# EAGLE schematic FlexEval (EAGLE 9.6.2)

## Sheet 1 of 5
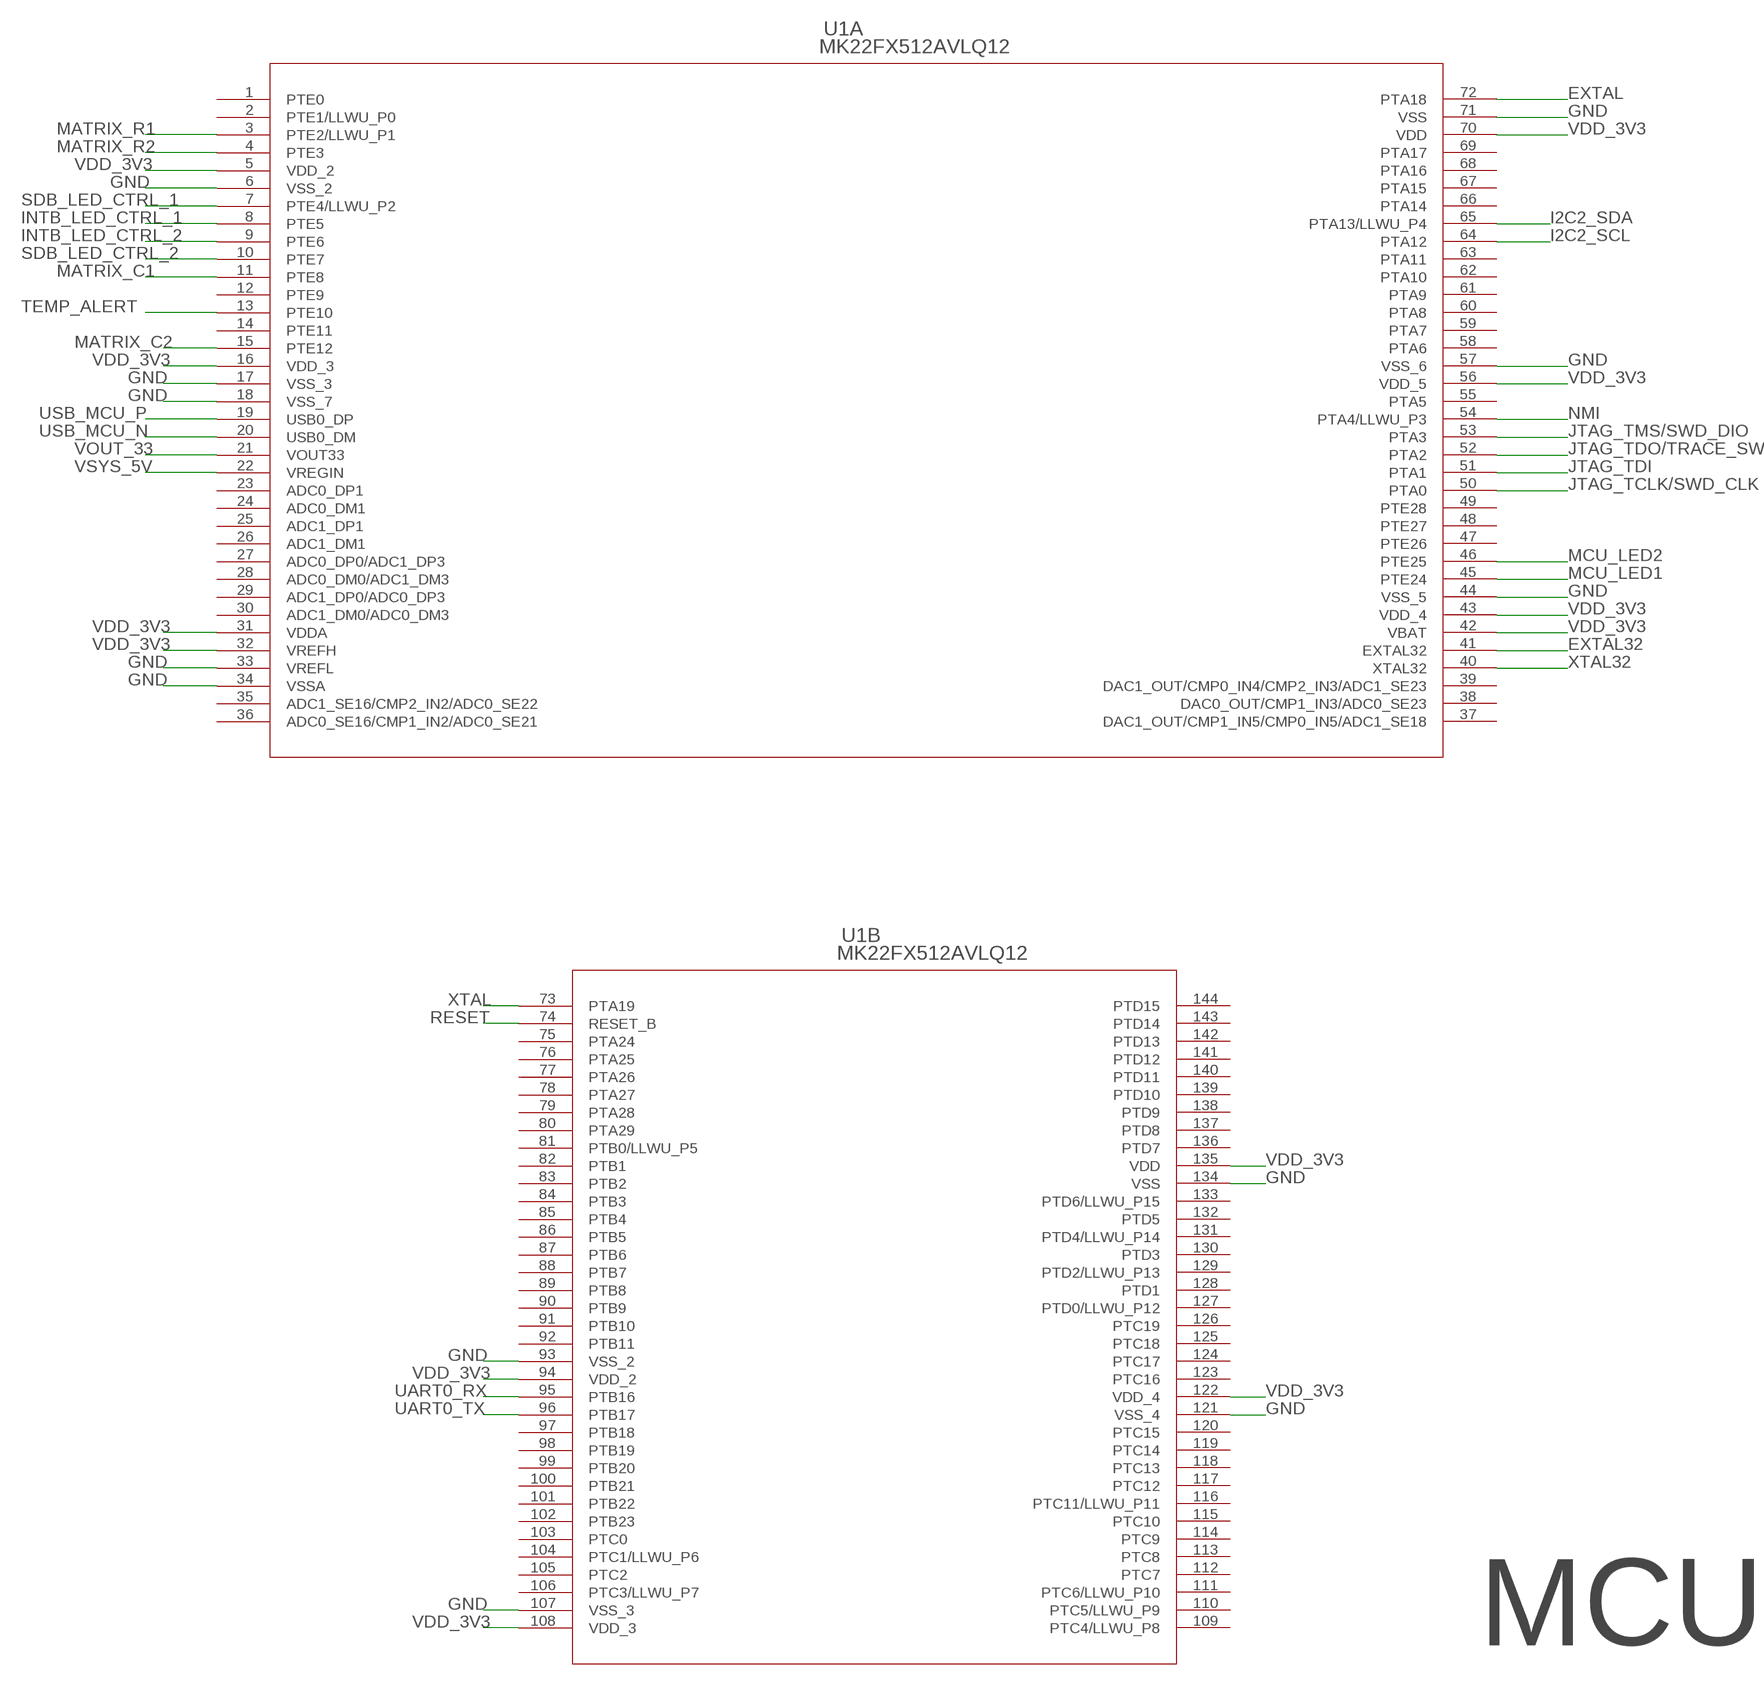
[diagram p0: schematic, sheet 1]

### Parts
U1  MK22FX512AVLQ12  [LQFP-144_20X20X1.6]

### Nets
EXTAL: U1.72(A:PTA18) ; also sheet 2
EXTAL32: U1.41(A:EXTAL32) ; also sheet 2
GND: U1.6(A:VSS_2) U1.17(A:VSS_3) U1.18(A:VSS_7) U1.33(A:VREFL) U1.34(A:VSSA) U1.44(A:VSS_5) U1.57(A:VSS_6) U1.71(A:VSS) U1.93(B:VSS_2) U1.107(B:VSS_3) U1.121(B:VSS_4) U1.134(B:VSS) ; also sheet 2,3,5
I2C2_SCL: U1.64(A:PTA12) ; also sheet 2,3,5
I2C2_SDA: U1.65(A:PTA13/LLWU_P4) ; also sheet 2,3,5
INTB_LED_CTRL_1: U1.8(A:PTE5) ; also sheet 3
INTB_LED_CTRL_2: U1.9(A:PTE6) ; also sheet 3
JTAG_TCLK/SWD_CLK: U1.50(A:PTA0) ; also sheet 2
JTAG_TDI: U1.51(A:PTA1) ; also sheet 2
JTAG_TDO/TRACE_SWO: U1.52(A:PTA2) ; also sheet 2
JTAG_TMS/SWD_DIO: U1.53(A:PTA3) ; also sheet 2
MATRIX_C1: U1.11(A:PTE8) ; also sheet 5
MATRIX_C2: U1.15(A:PTE12) ; also sheet 5
MATRIX_R1: U1.3(A:PTE2/LLWU_P1) ; also sheet 5
MATRIX_R2: U1.4(A:PTE3) ; also sheet 5
MCU_LED1: U1.45(A:PTE24) ; also sheet 2
MCU_LED2: U1.46(A:PTE25) ; also sheet 2
NMI: U1.54(A:PTA4/LLWU_P3) ; also sheet 2
RESET: U1.74(B:RESET_B) ; also sheet 2
SDB_LED_CTRL_1: U1.7(A:PTE4/LLWU_P2) ; also sheet 3
SDB_LED_CTRL_2: U1.10(A:PTE7) ; also sheet 3
TEMP_ALERT: U1.13(A:PTE10) ; also sheet 5
UART0_RX: U1.95(B:PTB16) ; also sheet 2
UART0_TX: U1.96(B:PTB17) ; also sheet 2
USB_MCU_N: U1.20(A:USB0_DM) ; also sheet 2
USB_MCU_P: U1.19(A:USB0_DP) ; also sheet 2
VDD_3V3: U1.5(A:VDD_2) U1.16(A:VDD_3) U1.31(A:VDDA) U1.32(A:VREFH) U1.42(A:VBAT) U1.43(A:VDD_4) U1.56(A:VDD_5) U1.70(A:VDD) U1.94(B:VDD_2) U1.108(B:VDD_3) U1.122(B:VDD_4) U1.135(B:VDD) ; also sheet 2,3,5
VOUT_33: U1.21(A:VOUT33) ; also sheet 2
VSYS_5V: U1.22(A:VREGIN) ; also sheet 2,3
XTAL: U1.73(B:PTA19) ; also sheet 2
XTAL32: U1.40(A:XTAL32) ; also sheet 2
Unconnected: U1.1(A:PTE0) U1.2(A:PTE1/LLWU_P0) U1.12(A:PTE9) U1.14(A:PTE11) U1.23(A:ADC0_DP1) U1.24(A:ADC0_DM1) U1.25(A:ADC1_DP1) U1.26(A:ADC1_DM1) U1.27(A:ADC0_DP0/ADC1_DP3) U1.28(A:ADC0_DM0/ADC1_DM3) U1.29(A:ADC1_DP0/ADC0_DP3) U1.30(A:ADC1_DM0/ADC0_DM3) U1.35(A:ADC1_SE16/CMP2_IN2/ADC0_SE22) U1.36(A:ADC0_SE16/CMP1_IN2/ADC0_SE21) U1.37(A:DAC1_OUT/CMP1_IN5/CMP0_IN5/ADC1_SE18) U1.38(A:DAC0_OUT/CMP1_IN3/ADC0_SE23) U1.39(A:DAC1_OUT/CMP0_IN4/CMP2_IN3/ADC1_SE23) U1.47(A:PTE26) U1.48(A:PTE27) U1.49(A:PTE28) U1.55(A:PTA5) U1.58(A:PTA6) U1.59(A:PTA7) U1.60(A:PTA8) U1.61(A:PTA9) U1.62(A:PTA10) U1.63(A:PTA11) U1.66(A:PTA14) U1.67(A:PTA15) U1.68(A:PTA16) U1.69(A:PTA17) U1.75(B:PTA24) U1.76(B:PTA25) U1.77(B:PTA26) U1.78(B:PTA27) U1.79(B:PTA28) U1.80(B:PTA29) U1.81(B:PTB0/LLWU_P5) U1.82(B:PTB1) U1.83(B:PTB2) U1.84(B:PTB3) U1.85(B:PTB4) U1.86(B:PTB5) U1.87(B:PTB6) U1.88(B:PTB7) U1.89(B:PTB8) U1.90(B:PTB9) U1.91(B:PTB10) U1.92(B:PTB11) U1.97(B:PTB18) U1.98(B:PTB19) U1.99(B:PTB20) U1.100(B:PTB21) U1.101(B:PTB22) U1.102(B:PTB23) U1.103(B:PTC0) U1.104(B:PTC1/LLWU_P6) U1.105(B:PTC2) U1.106(B:PTC3/LLWU_P7) U1.109(B:PTC4/LLWU_P8) U1.110(B:PTC5/LLWU_P9) U1.111(B:PTC6/LLWU_P10) U1.112(B:PTC7) U1.113(B:PTC8) U1.114(B:PTC9) U1.115(B:PTC10) U1.116(B:PTC11/LLWU_P11) U1.117(B:PTC12) U1.118(B:PTC13) U1.119(B:PTC14) U1.120(B:PTC15) U1.123(B:PTC16) U1.124(B:PTC17) U1.125(B:PTC18) U1.126(B:PTC19) U1.127(B:PTD0/LLWU_P12) U1.128(B:PTD1) U1.129(B:PTD2/LLWU_P13) U1.130(B:PTD3) U1.131(B:PTD4/LLWU_P14) U1.132(B:PTD5) U1.133(B:PTD6/LLWU_P15) U1.136(B:PTD7) U1.137(B:PTD8) U1.138(B:PTD9) U1.139(B:PTD10) U1.140(B:PTD11) U1.141(B:PTD12) U1.142(B:PTD13) U1.143(B:PTD14) U1.144(B:PTD15)

### Notes on the sheet
- MCU

## Sheet 2 of 5
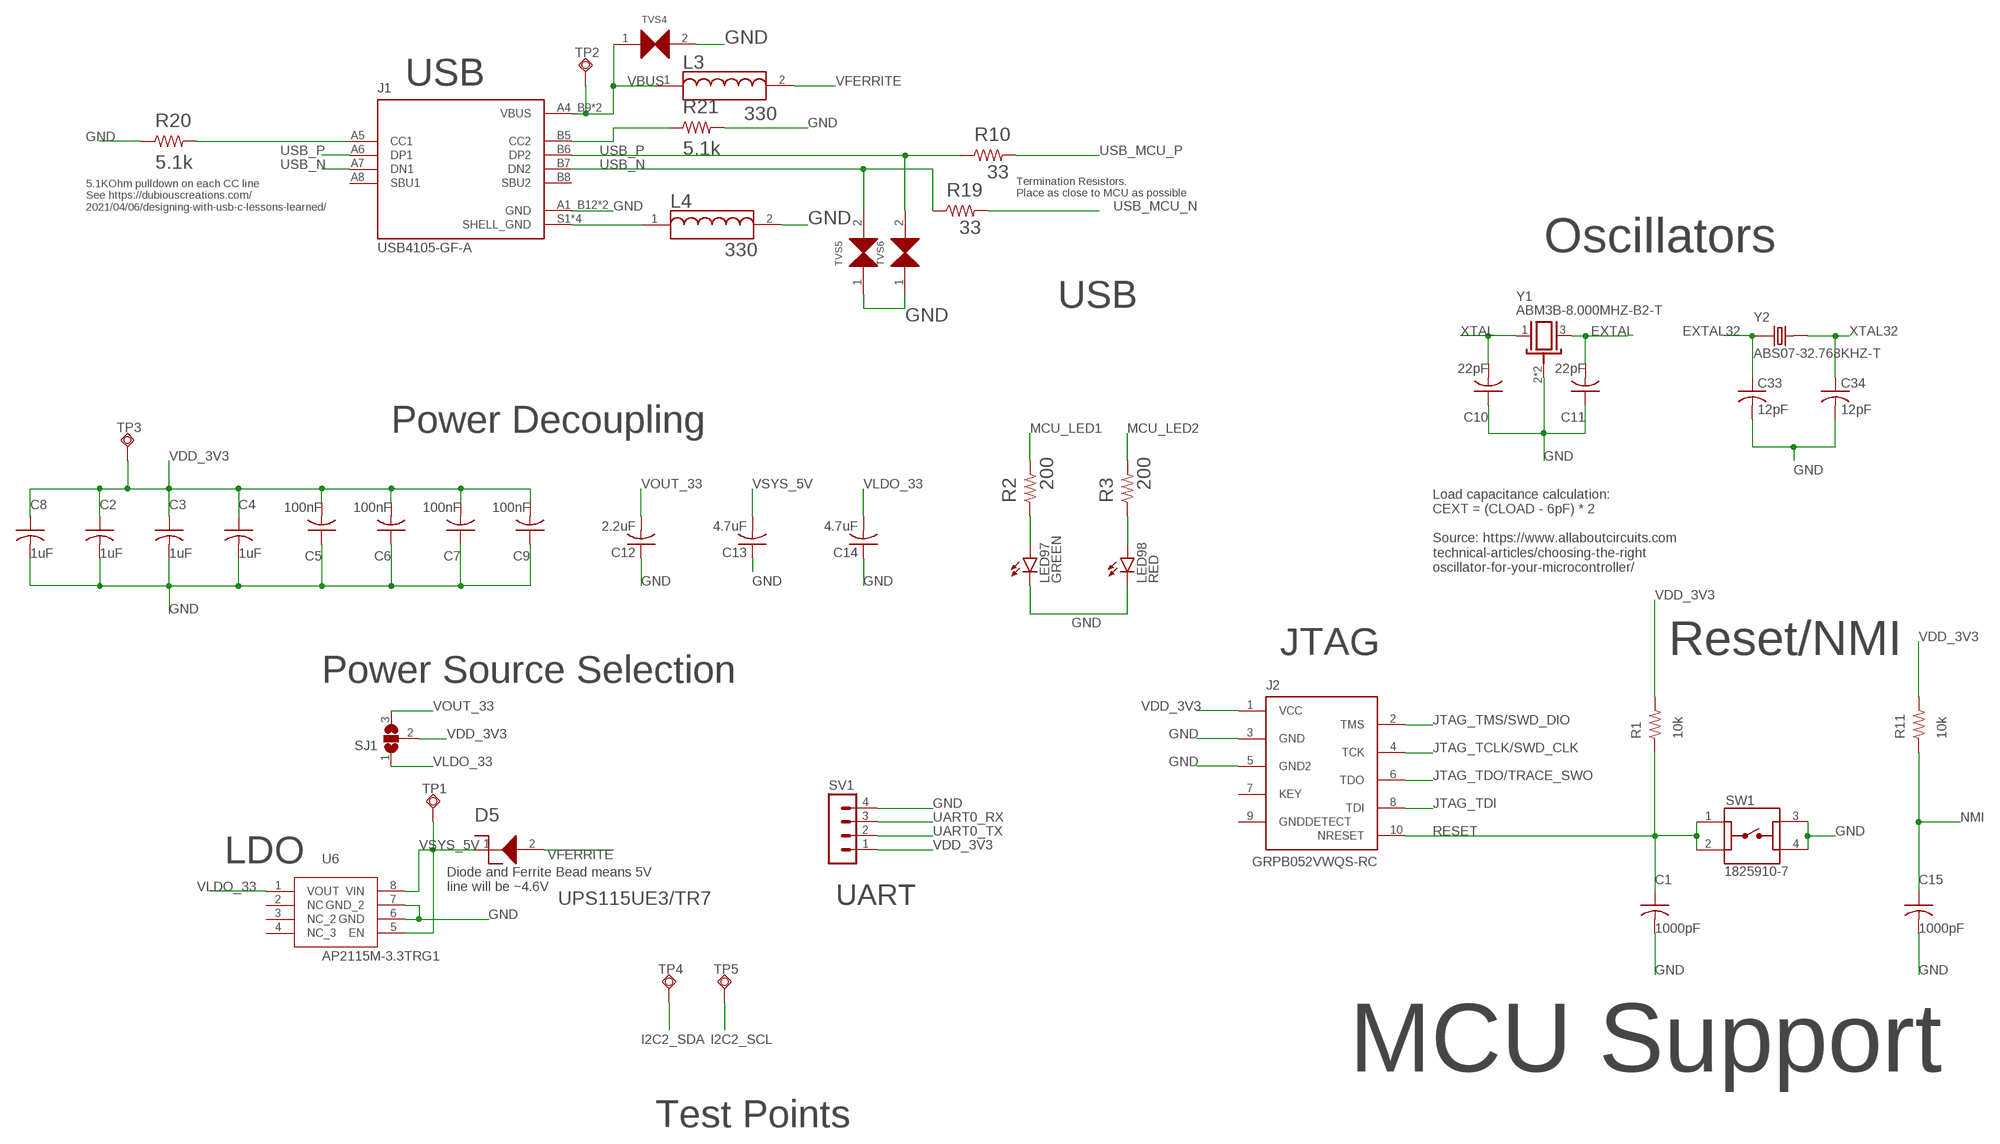
[diagram p1: schematic, sheet 2]

### Parts
C1  1000pF  C-USC1206  [C1206]
C2  1uF  C-USC1206  [C1206]
C3  1uF  C-USC1206  [C1206]
C4  1uF  C-USC1206  [C1206]
C5  100nF  C-USC1206  [C1206]
C6  100nF  C-USC1206  [C1206]
C7  100nF  C-USC1206  [C1206]
C8  1uF  C-USC1206  [C1206]
C9  100nF  C-USC1206  [C1206]
C10  22pF  C-USC1206  [C1206]
C11  22pF  C-USC1206  [C1206]
C12  2.2uF  C-USC0805  [C0805]
C13  4.7uF  C-USC0805  [C0805]
C14  4.7uF  C-USC0805  [C0805]
C15  1000pF  C-USC1206  [C1206]
C33  12pF  C-USC0805  [C0805]
C34  12pF  C-USC0805  [C0805]
D5  UPS115UE3/TR7  [UPS115UE3/TR7]
J1  USB4105-GF-A  [GCT_USB4105-GF-A]
J2  GRPB052VWQS-RC  [DEBUG]
L3  330  782853331SMD  [78285333]
L4  330  782853331SMD  [78285333]
LED97  GREEN  LEDSML1206  [SML1206]
LED98  RED  LEDSML1206  [SML1206]
R1  10k  R-US_R1206  [R1206]
R2  200  R-US_R0805  [R0805]
R3  200  R-US_R0805  [R0805]
R10  33  R-US_R0805  [R0805]
R11  10k  R-US_R1206  [R1206]
R19  33  R-US_R0805  [R0805]
R20  5.1k  R-US_R0805  [R0805]
R21  5.1k  R-US_R0805  [R0805]
SJ1  SJ2W  [SJ_2]
SV1  MA04-1  [MA04-1]
SW1  1825910-7  [SW_1825910-7]
TP1  TPSQTP20R  [TP20R]
TP2  TPSQTP20R  [TP20R]
TP3  TPSQTP20R  [TP20R]
TP4  TPSQTP20R  [TP20R]
TP5  TPSQTP20R  [TP20R]
TVS4  0603ESDA2-TR2  [0603ESDA2-TR2]
TVS5  0603ESDA2-TR2  [0603ESDA2-TR2]
TVS6  0603ESDA2-TR2  [0603ESDA2-TR2]
U6  AP2115M-3.3TRG1  [SOIC127P600X175-8N]
Y1  ABM3B-8.000MHZ-B2-T  [OSC_ABM3B-8.000MHZ-B2-T]
Y2  ABS07-32.768KHZ-T  [XTAL_ABS07-32.768KHZ-T]

### Nets
EXTAL: C11.2 Y1.3 ; also sheet 1
EXTAL32: C33.1 Y2.1 ; also sheet 1
GND: C1.2 C2.2 C3.2 C4.2 C5.1 C6.1 C7.1 C8.2 C9.1 C10.1 C11.1 C12.1 C13.1 C14.1 C15.2 C33.2 C34.2 J1.A1_B12(GND) J1.B1_A12(GND) J2.3(GND) J2.5(GND2) L4.2 LED97.C LED98.C R20.1 R21.2 SV1.4 SW1.3 SW1.4 TVS4.2 TVS5.1 TVS6.1 U6.6(GND) U6.7(GND_2) Y1.2(GND) Y1.4(GND) ; also sheet 1,3,5
I2C2_SCL: TP5.TP ; also sheet 1,3,5
I2C2_SDA: TP4.TP ; also sheet 1,3,5
JTAG_TCLK/SWD_CLK: J2.4(TCK) ; also sheet 1
JTAG_TDI: J2.8(TDI) ; also sheet 1
JTAG_TDO/TRACE_SWO: J2.6(TDO) ; also sheet 1
JTAG_TMS/SWD_DIO: J2.2(TMS) ; also sheet 1
MCU_LED1: R2.2 ; also sheet 1
MCU_LED2: R3.2 ; also sheet 1
N$1: LED97.A R2.1
N$2: LED98.A R3.1
N$12: J1.S1(SHELL_GND) J1.S2(SHELL_GND) J1.S3(SHELL_GND) J1.S4(SHELL_GND) L4.1
N$13: J1.B5(CC2) R21.1
N$14: J1.A5(CC1) R20.2
NMI: C15.1 R11.1 ; also sheet 1
RESET: C1.1 J2.10(NRESET) R1.1 SW1.1 SW1.2 ; also sheet 1
UART0_RX: SV1.3 ; also sheet 1
UART0_TX: SV1.2 ; also sheet 1
USB_MCU_N: R19.2 ; also sheet 1
USB_MCU_P: R10.2 ; also sheet 1
USB_N: J1.A7(DN1) J1.B7(DN2) R19.1 TVS5.2
USB_P: J1.A6(DP1) J1.B6(DP2) R10.1 TVS6.2
VBUS: J1.A4_B9(VBUS) J1.B4_A9(VBUS) L3.1 TP2.TP TVS4.1
VDD_3V3: C2.1 C3.1 C4.1 C5.2 C6.2 C7.2 C8.1 C9.2 J2.1(VCC) R1.2 R11.2 SJ1.2 SV1.1 TP3.TP ; also sheet 1,3,5
VFERRITE: D5.2 L3.2
VLDO_33: C14.2 SJ1.1 U6.1(VOUT)
VOUT_33: C12.2 SJ1.3 ; also sheet 1
VSYS_5V: C13.2 D5.1 TP1.TP U6.5(EN) U6.8(VIN) ; also sheet 1,3
XTAL: C10.2 Y1.1 ; also sheet 1
XTAL32: C34.1 Y2.2 ; also sheet 1
Unconnected: J1.A8(SBU1) J1.B8(SBU2) J2.7(KEY) J2.9(GNDDETECT) U6.2(NC) U6.3(NC_2) U6.4(NC_3)

### Notes on the sheet
- USB
- Termination Resistors.
  Place as close to MCU as possible
- 5.1KOhm pulldown on each CC line
  See https://dubiouscreations.com/
  2021/04/06/designing-with-usb-c-lessons-learned/
- Oscillators
- USB
- Power Decoupling
- Load capacitance calculation:
  CEXT = (CLOAD - 6pF) * 2
  
  Source: https://www.allaboutcircuits.com
  technical-articles/choosing-the-right
  oscillator-for-your-microcontroller/
- JTAG | Reset/NMI
- Power Source Selection
- LDO
- Diode and Ferrite Bead means 5V
  line will be ~4.6V
- UART
- MCU Support
- Test Points

## Sheet 3 of 5
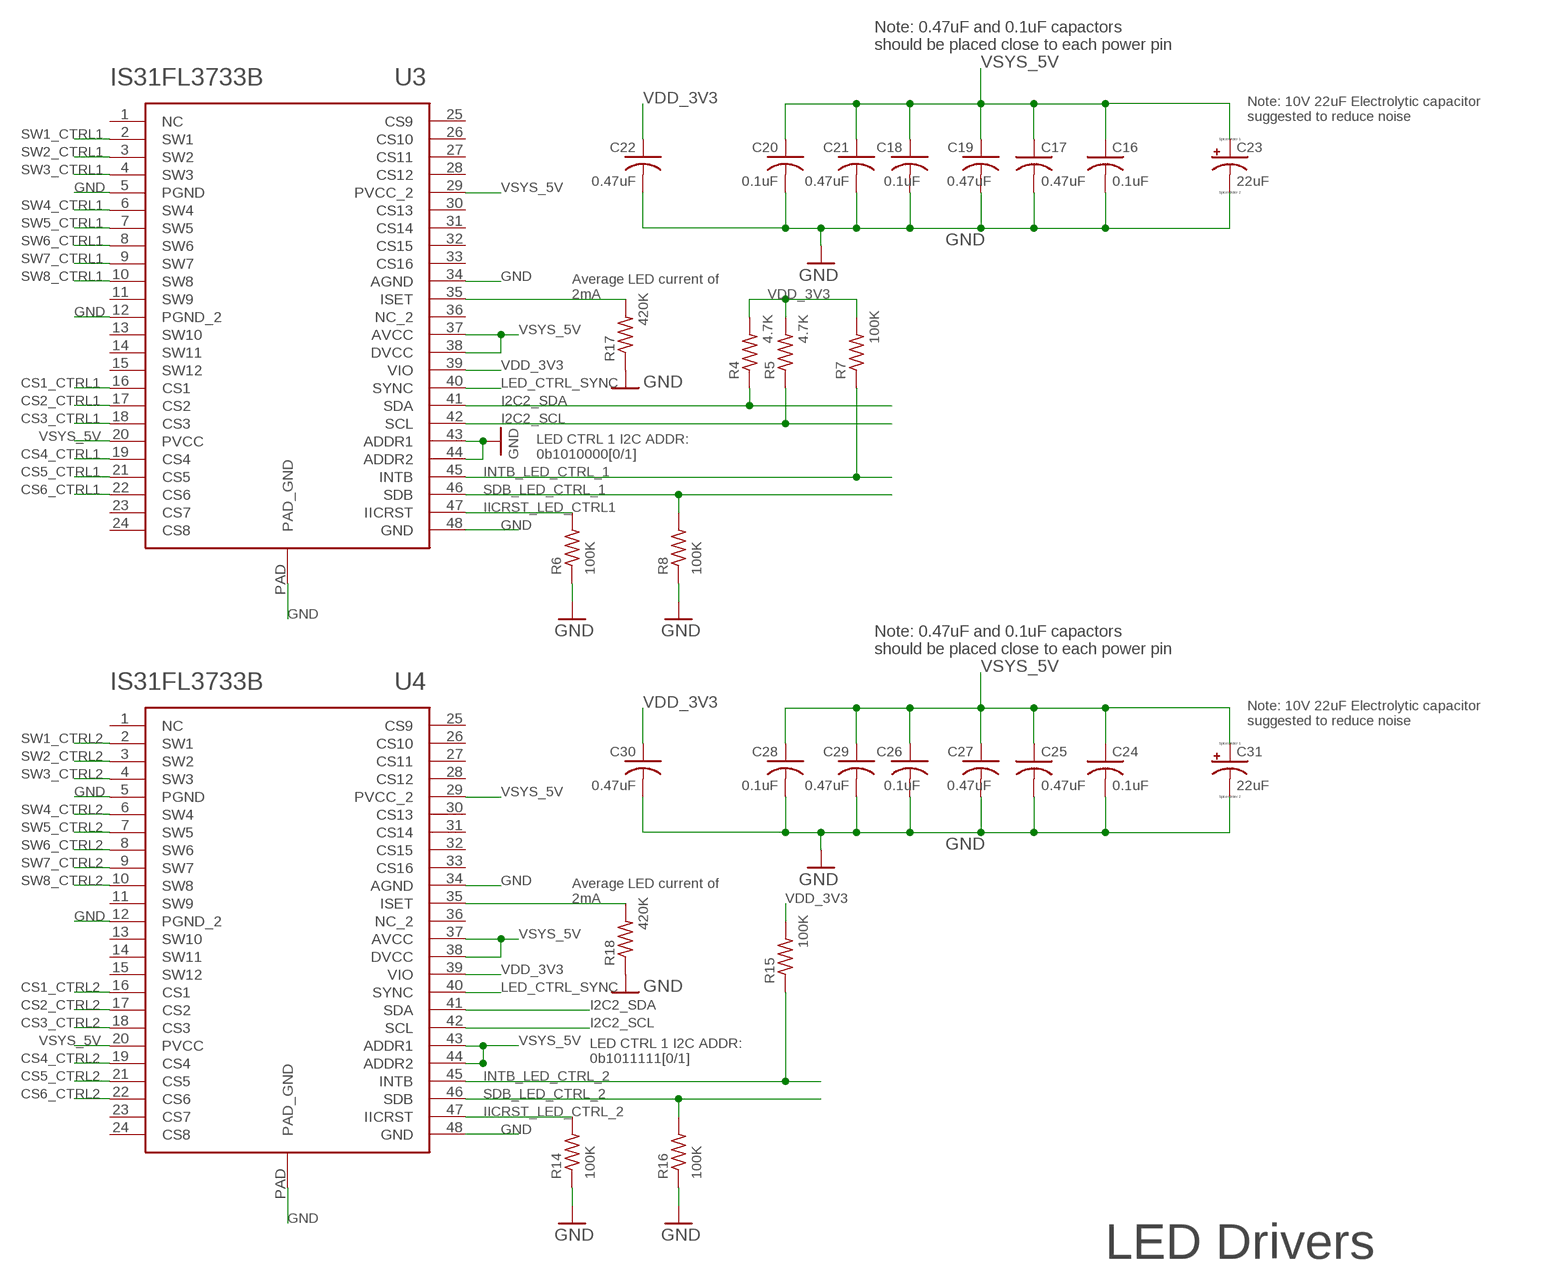
[diagram p2: schematic, sheet 3]

### Parts
C16  0.1uF  C-USC0805  [C0805]
C17  0.47uF  C-USC0805  [C0805]
C18  0.1uF  C-USC0805  [C0805]
C19  0.47uF  C-USC0805  [C0805]
C20  0.1uF  C-USC0805  [C0805]
C21  0.47uF  C-USC0805  [C0805]
C22  0.47uF  C-USC0805  [C0805]
C23  22uF  860020672011  [860020672011]
C24  0.1uF  C-USC0805  [C0805]
C25  0.47uF  C-USC0805  [C0805]
C26  0.1uF  C-USC0805  [C0805]
C27  0.47uF  C-USC0805  [C0805]
C28  0.1uF  C-USC0805  [C0805]
C29  0.47uF  C-USC0805  [C0805]
C30  0.47uF  C-USC0805  [C0805]
C31  22uF  860020672011  [860020672011]
R4  4.7K  R-US_R0805  [R0805]
R5  4.7K  R-US_R0805  [R0805]
R6  100K  R-US_R0805  [R0805]
R7  100K  R-US_R0805  [R0805]
R8  100K  R-US_R0805  [R0805]
R14  100K  R-US_R0805  [R0805]
R15  100K  R-US_R0805  [R0805]
R16  100K  R-US_R0805  [R0805]
R17  420K  R-US_R0805  [R0805]
R18  420K  R-US_R0805  [R0805]
U3  IS31FL3733B-TQLS4  [IS31FL3733B-TQLS4]
U4  IS31FL3733B-TQLS4  [IS31FL3733B-TQLS4]

### Nets
CS1_CTRL1: U3.16(CS1) ; also sheet 4
CS1_CTRL2: U4.16(CS1) ; also sheet 4
CS2_CTRL1: U3.17(CS2) ; also sheet 4
CS2_CTRL2: U4.17(CS2) ; also sheet 4
CS3_CTRL1: U3.18(CS3) ; also sheet 4
CS3_CTRL2: U4.18(CS3) ; also sheet 4
CS4_CTRL1: U3.19(CS4) ; also sheet 4
CS4_CTRL2: U4.19(CS4) ; also sheet 4
CS5_CTRL1: U3.21(CS5) ; also sheet 4
CS5_CTRL2: U4.21(CS5) ; also sheet 4
CS6_CTRL1: U3.22(CS6) ; also sheet 4
CS6_CTRL2: U4.22(CS6) ; also sheet 4
GND: C16.2 C17.2 C18.2 C19.2 C20.2 C21.2 C22.2 C23.- C24.2 C25.2 C26.2 C27.2 C28.2 C29.2 C30.2 C31.- R6.1 R8.1 R14.1 R16.1 R17.1 R18.1 U3.5(PGND) U3.12(PGND_2) U3.34(AGND) U3.43(ADDR1) U3.44(ADDR2) U3.48(GND) U3.PAD(PAD_GND) U4.5(PGND) U4.12(PGND_2) U4.34(AGND) U4.48(GND) U4.PAD(PAD_GND) ; also sheet 1,2,5
I2C2_SCL: R5.1 U3.42(SCL) U4.42(SCL) ; also sheet 1,2,5
I2C2_SDA: R4.1 U3.41(SDA) U4.41(SDA) ; also sheet 1,2,5
IICRST_LED_CTRL1: R6.2 U3.47(IICRST)
IICRST_LED_CTRL_2: R14.2 U4.47(IICRST)
INTB_LED_CTRL_1: R7.1 U3.45(INTB) ; also sheet 1
INTB_LED_CTRL_2: R15.1 U4.45(INTB) ; also sheet 1
LED_CTRL_SYNC: U3.40(SYNC) U4.40(SYNC)
N$4: R17.2 U3.35(ISET)
N$5: R18.2 U4.35(ISET)
SDB_LED_CTRL_1: R8.2 U3.46(SDB) ; also sheet 1
SDB_LED_CTRL_2: R16.2 U4.46(SDB) ; also sheet 1
SW1_CTRL1: U3.2(SW1) ; also sheet 4
SW1_CTRL2: U4.2(SW1) ; also sheet 4
SW2_CTRL1: U3.3(SW2) ; also sheet 4
SW2_CTRL2: U4.3(SW2) ; also sheet 4
SW3_CTRL1: U3.4(SW3) ; also sheet 4
SW3_CTRL2: U4.4(SW3) ; also sheet 4
SW4_CTRL1: U3.6(SW4) ; also sheet 4
SW4_CTRL2: U4.6(SW4) ; also sheet 4
SW5_CTRL1: U3.7(SW5) ; also sheet 4
SW5_CTRL2: U4.7(SW5) ; also sheet 4
SW6_CTRL1: U3.8(SW6) ; also sheet 4
SW6_CTRL2: U4.8(SW6) ; also sheet 4
SW7_CTRL1: U3.9(SW7) ; also sheet 4
SW7_CTRL2: U4.9(SW7) ; also sheet 4
SW8_CTRL1: U3.10(SW8) ; also sheet 4
SW8_CTRL2: U4.10(SW8) ; also sheet 4
VDD_3V3: C22.1 C30.1 R4.2 R5.2 R7.2 R15.2 U3.39(VIO) U4.39(VIO) ; also sheet 1,2,5
VSYS_5V: C16.1 C17.1 C18.1 C19.1 C20.1 C21.1 C23.+ C24.1 C25.1 C26.1 C27.1 C28.1 C29.1 C31.+ U3.20(PVCC) U3.29(PVCC_2) U3.37(AVCC) U3.38(DVCC) U4.20(PVCC) U4.29(PVCC_2) U4.37(AVCC) U4.38(DVCC) U4.43(ADDR1) U4.44(ADDR2) ; also sheet 1,2
Unconnected: U3.1(NC) U3.11(SW9) U3.13(SW10) U3.14(SW11) U3.15(SW12) U3.23(CS7) U3.24(CS8) U3.25(CS9) U3.26(CS10) U3.27(CS11) U3.28(CS12) U3.30(CS13) U3.31(CS14) U3.32(CS15) U3.33(CS16) U3.36(NC_2) U4.1(NC) U4.11(SW9) U4.13(SW10) U4.14(SW11) U4.15(SW12) U4.23(CS7) U4.24(CS8) U4.25(CS9) U4.26(CS10) U4.27(CS11) U4.28(CS12) U4.30(CS13) U4.31(CS14) U4.32(CS15) U4.33(CS16) U4.36(NC_2)

### Notes on the sheet
- Note: 0.47uF and 0.1uF capactors
  should be placed close to each power pin
- Note: 10V 22uF Electrolytic capacitor
  suggested to reduce noise
- Average LED current of
  2mA
- LED CTRL 1 I2C ADDR:
  0b1010000[0/1]
- Note: 0.47uF and 0.1uF capactors
  should be placed close to each power pin
- Note: 10V 22uF Electrolytic capacitor
  suggested to reduce noise
- Average LED current of
  2mA
- LED CTRL 1 I2C ADDR:
  0b1011111[0/1]
- LED Drivers

## Sheet 4 of 5
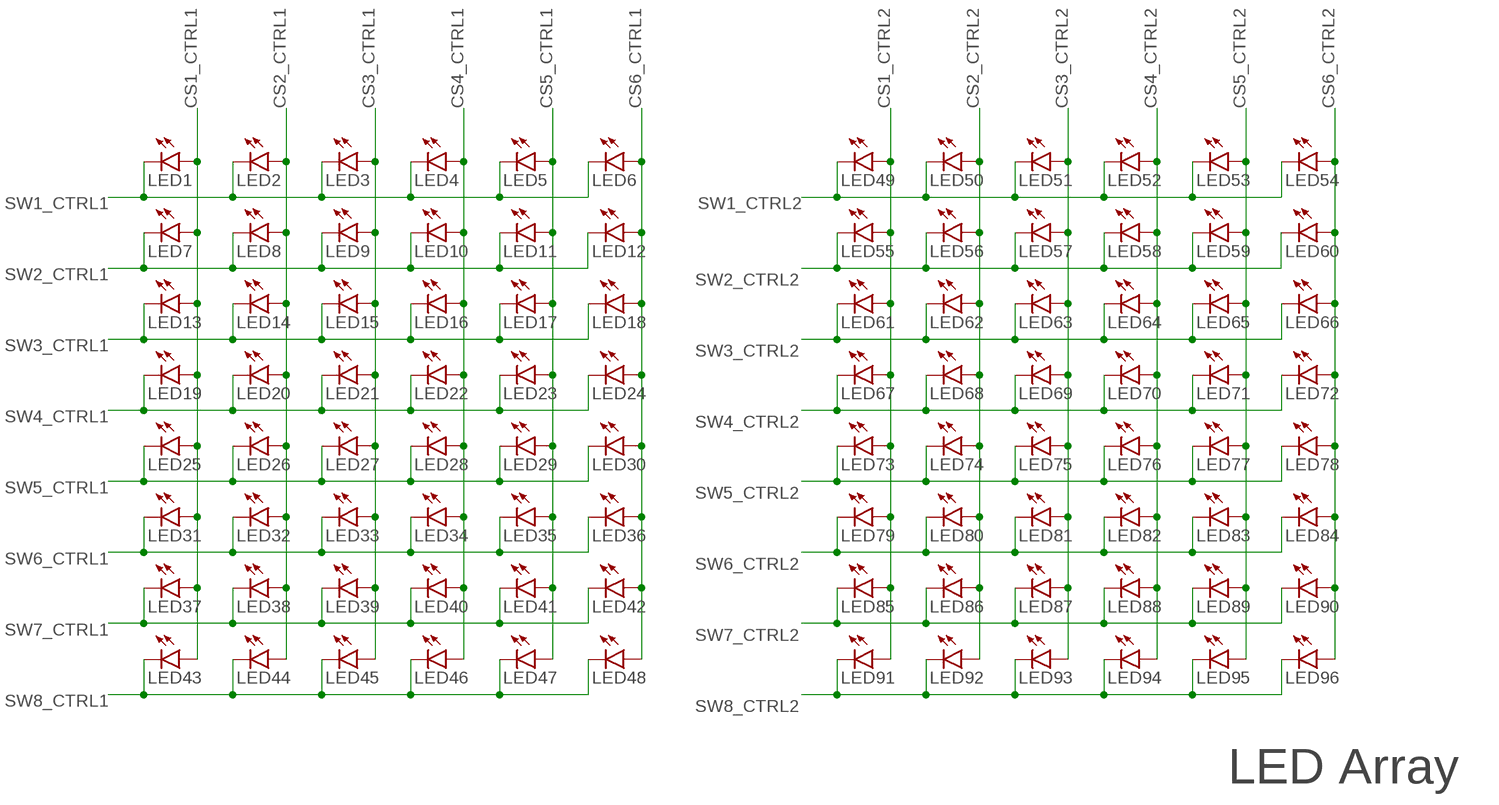
[diagram p3: schematic, sheet 4]

### Parts
LED1  LED3MM  [LED3MM]
LED2  LED3MM  [LED3MM]
LED3  LED3MM  [LED3MM]
LED4  LED3MM  [LED3MM]
LED5  LED3MM  [LED3MM]
LED6  LED3MM  [LED3MM]
LED7  LED3MM  [LED3MM]
LED8  LED3MM  [LED3MM]
LED9  LED3MM  [LED3MM]
LED10  LED3MM  [LED3MM]
LED11  LED3MM  [LED3MM]
LED12  LED3MM  [LED3MM]
LED13  LED3MM  [LED3MM]
LED14  LED3MM  [LED3MM]
LED15  LED3MM  [LED3MM]
LED16  LED3MM  [LED3MM]
LED17  LED3MM  [LED3MM]
LED18  LED3MM  [LED3MM]
LED19  LED3MM  [LED3MM]
LED20  LED3MM  [LED3MM]
LED21  LED3MM  [LED3MM]
LED22  LED3MM  [LED3MM]
LED23  LED3MM  [LED3MM]
LED24  LED3MM  [LED3MM]
LED25  LED3MM  [LED3MM]
LED26  LED3MM  [LED3MM]
LED27  LED3MM  [LED3MM]
LED28  LED3MM  [LED3MM]
LED29  LED3MM  [LED3MM]
LED30  LED3MM  [LED3MM]
LED31  LED3MM  [LED3MM]
LED32  LED3MM  [LED3MM]
LED33  LED3MM  [LED3MM]
LED34  LED3MM  [LED3MM]
LED35  LED3MM  [LED3MM]
LED36  LED3MM  [LED3MM]
LED37  LED3MM  [LED3MM]
LED38  LED3MM  [LED3MM]
LED39  LED3MM  [LED3MM]
LED40  LED3MM  [LED3MM]
LED41  LED3MM  [LED3MM]
LED42  LED3MM  [LED3MM]
LED43  LED3MM  [LED3MM]
LED44  LED3MM  [LED3MM]
LED45  LED3MM  [LED3MM]
LED46  LED3MM  [LED3MM]
LED47  LED3MM  [LED3MM]
LED48  LED3MM  [LED3MM]
LED49  LED3MM  [LED3MM]
LED50  LED3MM  [LED3MM]
LED51  LED3MM  [LED3MM]
LED52  LED3MM  [LED3MM]
LED53  LED3MM  [LED3MM]
LED54  LED3MM  [LED3MM]
LED55  LED3MM  [LED3MM]
LED56  LED3MM  [LED3MM]
LED57  LED3MM  [LED3MM]
LED58  LED3MM  [LED3MM]
LED59  LED3MM  [LED3MM]
LED60  LED3MM  [LED3MM]
LED61  LED3MM  [LED3MM]
LED62  LED3MM  [LED3MM]
LED63  LED3MM  [LED3MM]
LED64  LED3MM  [LED3MM]
LED65  LED3MM  [LED3MM]
LED66  LED3MM  [LED3MM]
LED67  LED3MM  [LED3MM]
LED68  LED3MM  [LED3MM]
LED69  LED3MM  [LED3MM]
LED70  LED3MM  [LED3MM]
LED71  LED3MM  [LED3MM]
LED72  LED3MM  [LED3MM]
LED73  LED3MM  [LED3MM]
LED74  LED3MM  [LED3MM]
LED75  LED3MM  [LED3MM]
LED76  LED3MM  [LED3MM]
LED77  LED3MM  [LED3MM]
LED78  LED3MM  [LED3MM]
LED79  LED3MM  [LED3MM]
LED80  LED3MM  [LED3MM]
LED81  LED3MM  [LED3MM]
LED82  LED3MM  [LED3MM]
LED83  LED3MM  [LED3MM]
LED84  LED3MM  [LED3MM]
LED85  LED3MM  [LED3MM]
LED86  LED3MM  [LED3MM]
LED87  LED3MM  [LED3MM]
LED88  LED3MM  [LED3MM]
LED89  LED3MM  [LED3MM]
LED90  LED3MM  [LED3MM]
LED91  LED3MM  [LED3MM]
LED92  LED3MM  [LED3MM]
LED93  LED3MM  [LED3MM]
LED94  LED3MM  [LED3MM]
LED95  LED3MM  [LED3MM]
LED96  LED3MM  [LED3MM]

### Nets
CS1_CTRL1: LED1.A LED7.A LED13.A LED19.A LED25.A LED31.A LED37.A LED43.A ; also sheet 3
CS1_CTRL2: LED49.A LED55.A LED61.A LED67.A LED73.A LED79.A LED85.A LED91.A ; also sheet 3
CS2_CTRL1: LED2.A LED8.A LED14.A LED20.A LED26.A LED32.A LED38.A LED44.A ; also sheet 3
CS2_CTRL2: LED50.A LED56.A LED62.A LED68.A LED74.A LED80.A LED86.A LED92.A ; also sheet 3
CS3_CTRL1: LED3.A LED9.A LED15.A LED21.A LED27.A LED33.A LED39.A LED45.A ; also sheet 3
CS3_CTRL2: LED51.A LED57.A LED63.A LED69.A LED75.A LED81.A LED87.A LED93.A ; also sheet 3
CS4_CTRL1: LED4.A LED10.A LED16.A LED22.A LED28.A LED34.A LED40.A LED46.A ; also sheet 3
CS4_CTRL2: LED52.A LED58.A LED64.A LED70.A LED76.A LED82.A LED88.A LED94.A ; also sheet 3
CS5_CTRL1: LED5.A LED11.A LED17.A LED23.A LED29.A LED35.A LED41.A LED47.A ; also sheet 3
CS5_CTRL2: LED53.A LED59.A LED65.A LED71.A LED77.A LED83.A LED89.A LED95.A ; also sheet 3
CS6_CTRL1: LED6.A LED12.A LED18.A LED24.A LED30.A LED36.A LED42.A LED48.A ; also sheet 3
CS6_CTRL2: LED54.A LED60.A LED66.A LED72.A LED78.A LED84.A LED90.A LED96.A ; also sheet 3
SW1_CTRL1: LED1.K(C) LED2.K(C) LED3.K(C) LED4.K(C) LED5.K(C) LED6.K(C) ; also sheet 3
SW1_CTRL2: LED49.K(C) LED50.K(C) LED51.K(C) LED52.K(C) LED53.K(C) LED54.K(C) ; also sheet 3
SW2_CTRL1: LED7.K(C) LED8.K(C) LED9.K(C) LED10.K(C) LED11.K(C) LED12.K(C) ; also sheet 3
SW2_CTRL2: LED55.K(C) LED56.K(C) LED57.K(C) LED58.K(C) LED59.K(C) LED60.K(C) ; also sheet 3
SW3_CTRL1: LED13.K(C) LED14.K(C) LED15.K(C) LED16.K(C) LED17.K(C) LED18.K(C) ; also sheet 3
SW3_CTRL2: LED61.K(C) LED62.K(C) LED63.K(C) LED64.K(C) LED65.K(C) LED66.K(C) ; also sheet 3
SW4_CTRL1: LED19.K(C) LED20.K(C) LED21.K(C) LED22.K(C) LED23.K(C) LED24.K(C) ; also sheet 3
SW4_CTRL2: LED67.K(C) LED68.K(C) LED69.K(C) LED70.K(C) LED71.K(C) LED72.K(C) ; also sheet 3
SW5_CTRL1: LED25.K(C) LED26.K(C) LED27.K(C) LED28.K(C) LED29.K(C) LED30.K(C) ; also sheet 3
SW5_CTRL2: LED73.K(C) LED74.K(C) LED75.K(C) LED76.K(C) LED77.K(C) LED78.K(C) ; also sheet 3
SW6_CTRL1: LED31.K(C) LED32.K(C) LED33.K(C) LED34.K(C) LED35.K(C) LED36.K(C) ; also sheet 3
SW6_CTRL2: LED79.K(C) LED80.K(C) LED81.K(C) LED82.K(C) LED83.K(C) LED84.K(C) ; also sheet 3
SW7_CTRL1: LED37.K(C) LED38.K(C) LED39.K(C) LED40.K(C) LED41.K(C) LED42.K(C) ; also sheet 3
SW7_CTRL2: LED85.K(C) LED86.K(C) LED87.K(C) LED88.K(C) LED89.K(C) LED90.K(C) ; also sheet 3
SW8_CTRL1: LED43.K(C) LED44.K(C) LED45.K(C) LED46.K(C) LED47.K(C) LED48.K(C) ; also sheet 3
SW8_CTRL2: LED91.K(C) LED92.K(C) LED93.K(C) LED94.K(C) LED95.K(C) LED96.K(C) ; also sheet 3

### Notes on the sheet
- LED Array

## Sheet 5 of 5
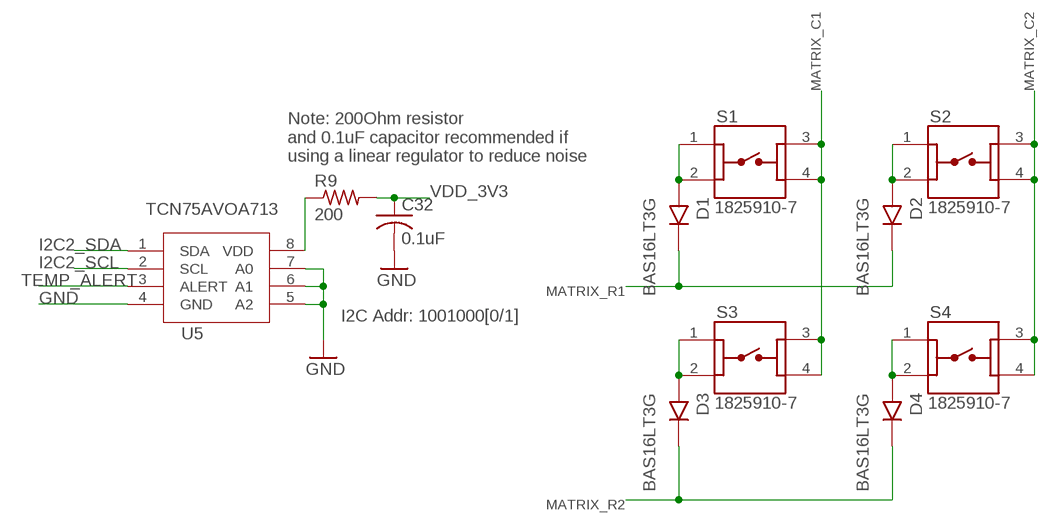
[diagram p4: schematic, sheet 5]

### Parts
C32  0.1uF  C-USC0805  [C0805]
D1  BAS16LT3G  [SOT95P240X111-3N]
D2  BAS16LT3G  [SOT95P240X111-3N]
D3  BAS16LT3G  [SOT95P240X111-3N]
D4  BAS16LT3G  [SOT95P240X111-3N]
R9  200  R-US_R0805  [R0805]
S1  1825910-7  [SW_1825910-7]
S2  1825910-7  [SW_1825910-7]
S3  1825910-7  [SW_1825910-7]
S4  1825910-7  [SW_1825910-7]
U5  SOIC127P600X175-8N  [SOIC127P600X175-8N]

### Nets
GND: C32.2 U5.4(GND) U5.5(A2) U5.6(A1) U5.7(A0) ; also sheet 1,2,3
I2C2_SCL: U5.2(SCL) ; also sheet 1,2,3
I2C2_SDA: U5.1(SDA) ; also sheet 1,2,3
MATRIX_C1: S1.3 S1.4 S3.3 S3.4 ; also sheet 1
MATRIX_C2: S2.3 S2.4 S4.3 S4.4 ; also sheet 1
MATRIX_R1: D1.3(C) D2.3(C) ; also sheet 1
MATRIX_R2: D3.3(C) D4.3(C) ; also sheet 1
N$6: D1.1(A) S1.1 S1.2
N$8: D2.1(A) S2.1 S2.2
N$9: D3.1(A) S3.1 S3.2
N$10: D4.1(A) S4.1 S4.2
N$11: R9.1 U5.8(VDD)
TEMP_ALERT: U5.3(ALERT) ; also sheet 1
VDD_3V3: C32.1 R9.2 ; also sheet 1,2,3

### Notes on the sheet
- Note: 200Ohm resistor
  and 0.1uF capacitor recommended if
  using a linear regulator to reduce noise
- I2C Addr: 1001000[0/1]

## Library data of the parts
C1-C22 C24-C30 C32-C34 = resistor:C-US: CAPACITOR, American symbol
C23 C31 = 860020672011:860020672011: 22uF 50V Electrolytic Capacitor Wurth 860020672011
D1-D4 = BAS16LT3G:BAS16LT3G: Diode Small Signal Switching 100V 0.2A Automotive 3-Pin SOT-23 T/R Check prices <https://pricing.snapeda.com/parts/BAS16LT3G/ON%20Semiconductor/view-part?ref=eda>; AVAILABILITY: In Stock; DESCRIPTION: Diode Standard 100V 200mA (DC) Surface Mount SOT-23-3 (TO-236); MF: ON Semiconductor; MP: BAS16LT3G; PACKAGE: SOT-23-3 ON Semiconductor; PRICE: None
D5 = UPS115UE3-TR7:UPS115UE3/TR7: UPS115UE3/TR7 Description: 15V Schottky Diode Max forward current: 1A Max forward voltage: 310mV Purchase: Mouser <https://www.mouser.com/ProductDetail/Microchip-Technology/UPS115UE3-TR7?qs=6jAvgNDGUA8Rt%252B%2FW9YCiwQ%3D%3D>
J1 = USB4105-GF-A:USB4105-GF-A: USB-C (USB TYPE-C) USB 2.0 Receptacle Connector 24 (16+8 Dummy) Position Surface Mount, Right Angle; Through Hole Check availability <https://pricing.snapeda.com/parts/USB4105-GF-A/GCT/view-part?ref=eda>; AVAILABILITY: In Stock; DESCRIPTION: USB-C (USB TYPE-C) USB 2.0 Receptacle Connector 24 (16+8 Dummy) Position Surface Mount, Right Angle; Through Hole; MF: GCT; MP: USB4105-GF-A; PACKAGE: None; PRICE: None; PURCHASE-URL: https://pricing.snapeda.com/search/part/USB4105-GF-A/?ref=eda
J2 = GRPB052VWQS-RC:GRPB052VWQS-RC: CONN HEADER 0.050" 10PS DL SMD AU reviewed: YES tested: YES Check availability <https://pricing.snapeda.com/parts/GRPB052VWQS-RC/Sullins%20Connector/view-part?ref=eda>; AVAILABILITY: In Stock; DESCRIPTION: Connector Header Surface Mount 10 position 0.050 (1.27mm); MF: Sullins Connector; MP: GRPB052VWQS-RC; PACKAGE: None; PRICE: None; PURCHASE-URL: https://pricing.snapeda.com/search/part/GRPB052VWQS-RC/?ref=eda
L3 L4 = 782853331:782853331: 782853331 Manufacturer: Würth Elektronik Product Number: 782853331 Description: 330 Ohms @ 100 MHz 1 Power Line Ferrite Bead 0805 (2012 Metric) 3A 50mOhm Package Size: 0805 (Metric) Purchase Link: Digikey <https://www.digikey.com/en/products/detail/w%C3%BCrth-elektronik/782853331/14670038>
LED1-LED98 = led:LED: LED OSRAM: - CHIPLED LG R971, LG N971, LY N971, LG Q971, LY Q971, LO R971, LY R971 LH N974, LH R974 LS Q976, LO Q976, LY Q976 LO Q996 - Hyper CHIPLED LW Q18S LB Q993, LB Q99A, LB R99A - SideLED LS A670, LO A670, LY A670, LG A670, LP A670 LB A673, LV A673, LT A673, LW A673 LH A674 LY A675 LS A676, LA A676, LO A676, LY A676, LW A676 LS A679, LY A679, LG A679 - Hyper Micro SIDELED® LS Y876, LA Y876, LO Y876, LY Y876 LT Y87S - SmartLED LW L88C, LW L88S LB L89C, LB L89S, LG L890 LS L89K, LO L89K, LY L89K LS L896, LA L896, LO L896, LY L896 - TOPLED LS T670, LO T670, LY T670, LG T670, LP T670 LSG T670, LSP T670, LSY T670, LOP T670, LYG T670 LG T671, LOG T671, LSG T671 LB T673, LV T673, LT T673, LW T673 LH T674 LS T676, LA T676, LO T676, LY T676, LB T676, LH T676, LSB T676, LW T676 LB T67C, LV T67C, LT T67C, LS T67K, LO T67K, LY T67K, LW E67C LS E67B, LA E67B, LO E67B, LY E67B, LB E67C, LV E67C, LT E67C LW T67C LS T679, LY T679, LG T679 LS T770, LO T770, LY T770, LG T770, LP T770 LB T773, LV T773, LT T773, LW T773 LH T774 LS E675, LA E675, LY E675, LS T675 LS T776, LA T776, LO T776, LY T776, LB T776 LHGB T686 LT T68C, LB T68C - Hyper Mini TOPLED® LB M676 - Mini TOPLED Santana® LG M470 LS M47K, LO M47K, LY M47K Source: http://www.osram.convergy.de LUXEON: - LUMILED® LXK2-PW12-R00, LXK2-PW12-S00, LXK2-PW14-U00, LXK2-PW14-V00 LXK2-PM12-R00, LXK2-PM12-S00, LXK2-PM14-U00 LXK2-PE12-Q00, LXK2-PE12-R00, LXK2-PE12-S00, LXK2-PE14-T00, LXK2-PE14-U00 LXK2-PB12-K00, LXK2-PB12-L00, LXK2-PB12-M00, LXK2-PB14-N00, LXK2-PB14-P00, LXK2-PB14-Q00 LXK2-PR12-L00, LXK2-PR12-M00, LXK2-PR14-Q00, LXK2-PR14-R00 LXK2-PD12-Q00, LXK2-PD12-R00, LXK2-PD12-S00 LXK2-PH12-R00, LXK2-PH12-S00 LXK2-PL12-P00, LXK2-PL12-Q00, LXK2-PL12-R00 Source: www.luxeon.com KINGBRIGHT: KA-3528ASYC Source: www.kingbright.com
R1-R11 R14-R21 = resistor:R-US_: RESISTOR, American symbol
S1-S4 SW1 = 1825910-7:1825910-7: Switch Tactile OFF (ON) SPST Round Button PC Pins 0.05A 24VDC 100000Cycles 2.55N Thru-Hole Loose Check availability <https://pricing.snapeda.com/parts/1825910-7/TE%20Connectivity/view-part?ref=eda>; AVAILABILITY: In Stock; COMMENT: 1825910-7; CONFIGURATION_POLE-THROW: Single Pole - Single Throw; CONTACT_CURRENT_RATING: 50 mA; DESCRIPTION: Switch Tactile OFF (ON) SPST Round Button PC Pins 0.05A 24VDC 100000Cycle 2.55N Thru-Hole Loose Piece; EU_ROHS_COMPLIANCE: Compliant; MF: TE Connectivity; MP: 1825910-7; PACKAGE: None; PRICE: None; PURCHASE-URL: https://pricing.snapeda.com/search/part/1825910-7/?ref=eda
SJ1 = jumper:SJ2W: SMD solder JUMPER
SV1 = con-lstb:MA04-1: PIN HEADER; OC_FARNELL: unknown; OC_NEWARK: unknown
TP1-TP5 = testpad:TPSQ: Test pad
TVS4-TVS6 = 0603ESDA2-TR2:0603ESDA2-TR2: TVS 0603ESDA2-TR2 Manufacturer: Eaton Product Number: 0603ESDA2-TR2 Description: SUPPRESSOR ESD 30VDC 0603 SMD Package: 0603 Purchase Link: Digikey <https://www.digikey.com/en/products/detail/eaton-electronics-division/0603ESDA2-TR2/3681416?s=N4IgTCBcDaIAwDY4GYCiBlAIgQTAWgBUAlCAXQF8g>
U1 = MK22FX512AVLQ12:MK22FX512AVLQ12; CPU: ARM Cortex-M4; FLASHKB: 512; MANUFACTURER_PART_NUMBER: MK22FX512AVLQ12; MAXFREQUENCY: 120; PINCOUNT: 144; SRAMKB: 128; VENDOR: NXP
U3 U4 = IS31FL3733B:IS31FL3733B-TQLS4: IS31FL3733B I2C Based Matrix LED driver. Capable of driving 16x12 matrix, and synchronizing outputs between multiple controllers
U5 = TCN75A:SOIC127P600X175-8N; A1_MIN: 0.1; A_MAX: 1.75; A_MIN: 1.75; A_NOM: 1.75; B_MAX: 0.51; B_MIN: 0.31; B_NOM: 0.41; D2_MAX: 0.0; D_MAX: 4.9; D_MIN: 4.9; D_NOM: 4.9; E1_MAX: 3.9; E1_MIN: 3.9; E1_NOM: 3.9; E2_MAX: 0.0; ENOM: 1.27; E_MAX: 6.0; E_MIN: 6.0; E_NOM: 6.0; L_MAX: 1.27; L_MIN: 0.4; L_NOM: 0.835; MANUFACTURER: hotchip; PIN_COUNT: 8.0; STANDARD: IPC 7351B
U6 = AP2115M-3.3TRG1:AP2115M-3.3TRG1: AP2115M-3.3TRG1 3.3V Low dropout regulator. 6V max input, 750mV max dropout voltage. Ordering link: Digikey <https://www.digikey.com/en/products/detail/diodes-incorporated/AP2115M-3-3TRG1/5305574>
Y1 = ABM3B-8.000MHZ-B2-T:ABM3B-8.000MHZ-B2-T: 8MHz ±20ppm Crystal 18pF 200 Ohms 4-SMD, No Lead Check availability <https://pricing.snapeda.com/parts/ABM3B-8.000MHZ-B2-T/Abracon/view-part?ref=eda> Check availability <https://pricing.snapeda.com/parts/ABM3B-8.000MHZ-B2-T/Abracon/view-part?ref=eda> Check availability <https://pricing.snapeda.com/parts/ABM3B-8.000MHZ-B2-T/Abracon/view-part?ref=eda>; AVAILABILITY: In Stock; DESCRIPTION: 8 MHz ±20ppm Crystal 18pF 200 Ohms 4-SMD, No Lead; MF: Abracon; MP: ABM3B-8.000MHZ-B2-T; PACKAGE: SMD-4 Abracon LLC; PRICE: None; PURCHASE-URL: https://pricing.snapeda.com/search/part/ABM3B-8.000MHZ-B2-T/?ref=eda
Y2 = ABS07-32.768KHZ-T:ABS07-32.768KHZ-T: ABS07 Series 32.768 kHz ±20 ppm 12.5 pF -40 to +85 °C SMT Low Profile Crystal Check availability <https://pricing.snapeda.com/parts/ABS07-32.768KHZ-T/Abracon/view-part?ref=eda>; AVAILABILITY: In Stock; DESCRIPTION: 32.768 kHz ±20ppm Crystal 12.5pF 70 kOhms 2-SMD, No Lead; MF: Abracon; MP: ABS07-32.768KHZ-T; PACKAGE: SMD-2 Abracon LLC; PRICE: None; PURCHASE-URL: https://pricing.snapeda.com/search/part/ABS07-32.768KHZ-T/?ref=eda